# Altium schematic sheet STM32G473CET6_PINOUT.SchDoc
size C; SheetNumber: 6; SheetTotal: 10
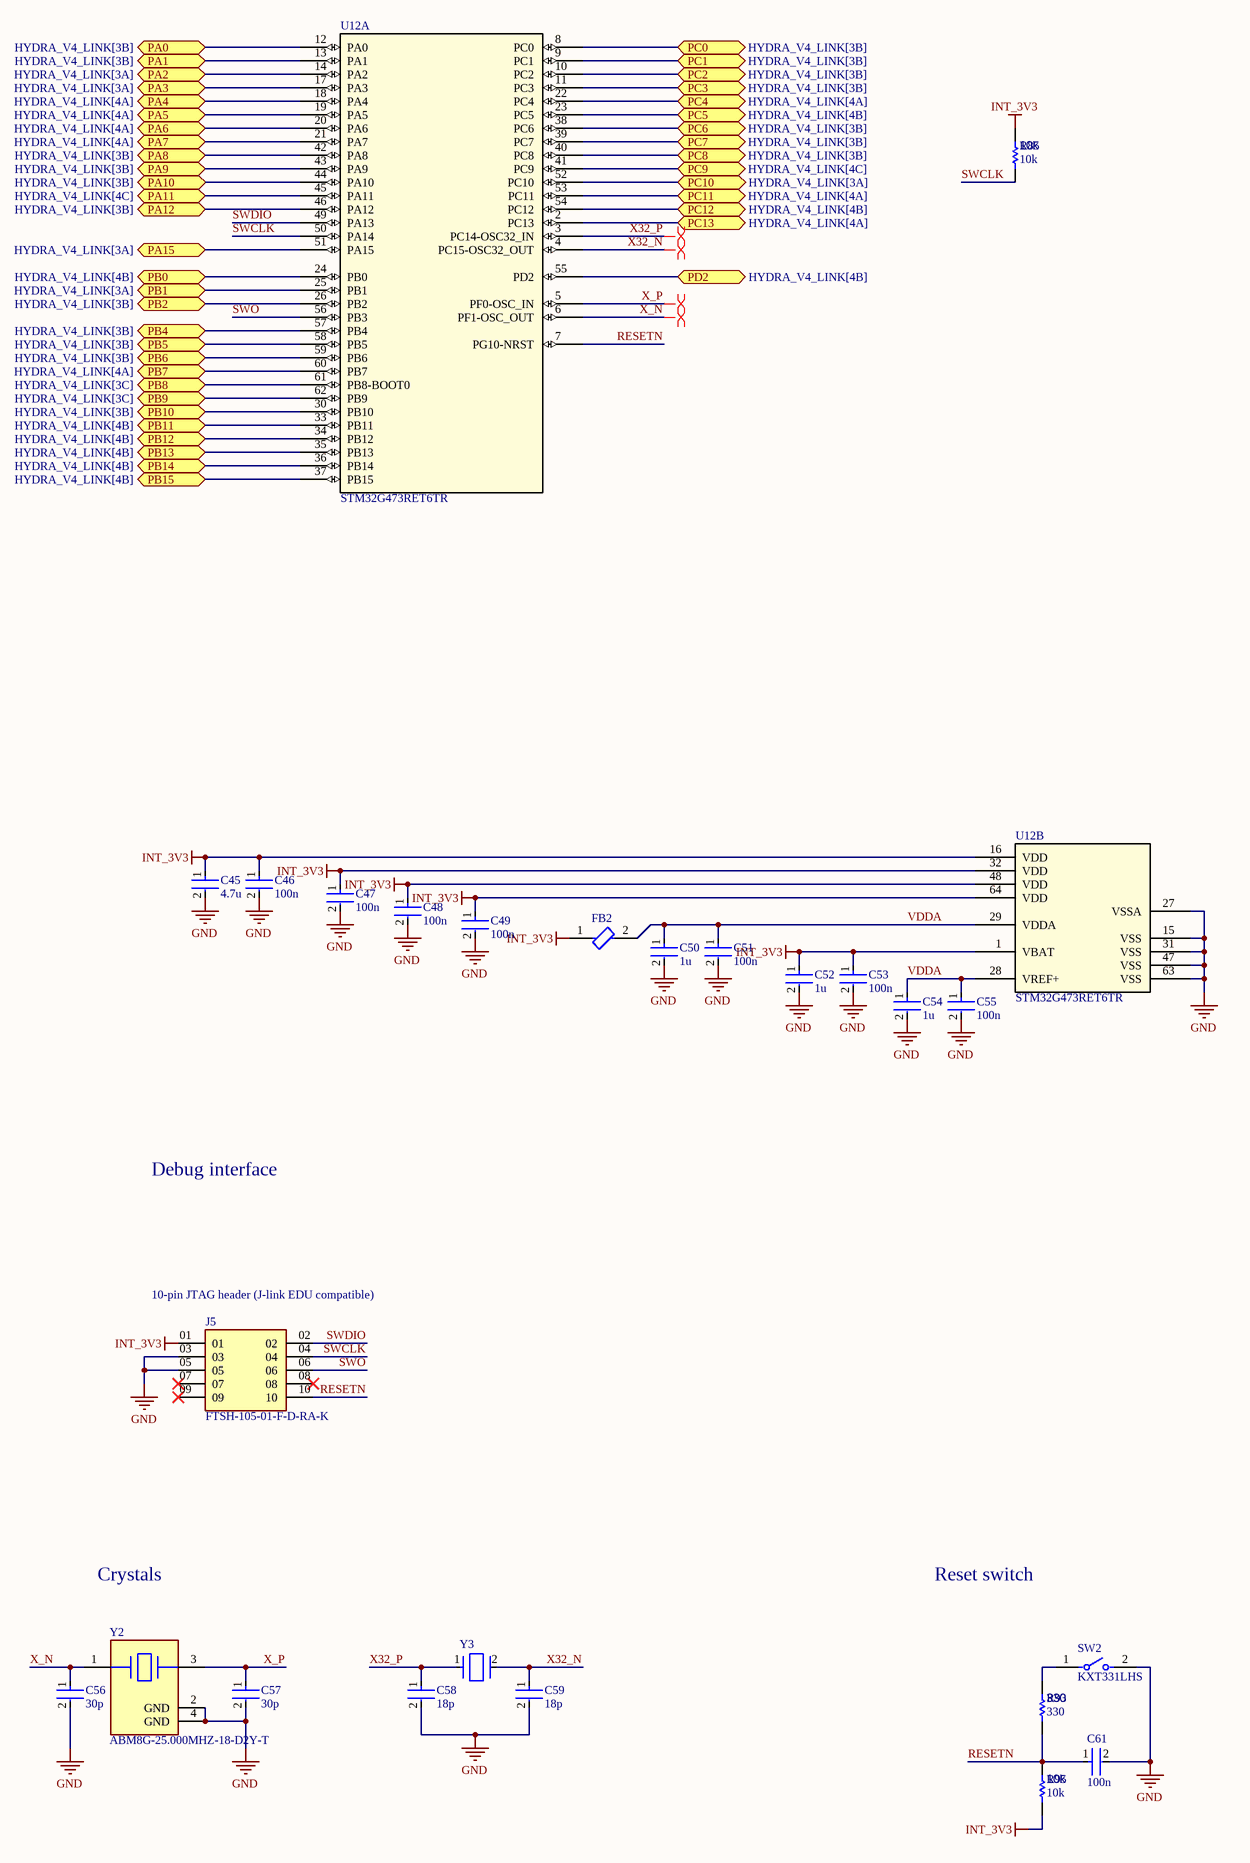
[diagram p0: STM32G473CET6_PINOUT.SchDoc]

## Parts
C45  4.7u  [FP-0402-L_1_0_0_05-W_0_5-IPC_A]
C46  100n  [FP-0402-L_1_0_0_05-W_0_5-IPC_A]
C47  100n  [FP-0402-L_1_0_0_05-W_0_5-IPC_A]
C48  100n  [FP-0402-L_1_0_0_05-W_0_5-IPC_A]
C49  100n  [FP-0402-L_1_0_0_05-W_0_5-IPC_A]
C50  1u  [FP-0402-L_1_0_0_05-W_0_5-IPC_A]
C51  100n  [FP-0402-L_1_0_0_05-W_0_5-IPC_A]
C52  1u  [FP-0402-L_1_0_0_05-W_0_5-IPC_A]
C53  100n  [FP-0402-L_1_0_0_05-W_0_5-IPC_A]
C54  1u  [FP-0402-L_1_0_0_05-W_0_5-IPC_A]
C55  100n  [FP-0402-L_1_0_0_05-W_0_5-IPC_A]
C56  30p  [FP-0402-L_1_0_0_05-W_0_5-IPC_A]
C57  30p  [FP-0402-L_1_0_0_05-W_0_5-IPC_A]
C58  18p  [FP-0402-L_1_0_0_05-W_0_5-IPC_A]
C59  18p  [FP-0402-L_1_0_0_05-W_0_5-IPC_A]
C61  100n  [FP-0402-L_1_0_0_05-W_0_5-IPC_A]
FB2  BLM15PX601SN1D  [FP-BLM15-0_05-MFG]  (value not drawn)
J5  FTSH-105-01-F-D-RA-K  [FTSH-105-01-F-D-RA-K-Footprint-1]
R85  10k  [R0603B]
R93  330  [R0603B]
R95  10k  [R0603B]
SW2  KXT331LHS  [FP-KXT331LHS-MFG]
U12  STM32G473RET6TR  [STM32G473RET6TR-Footprint-1]  (parts A,B of 2)
Y2  ABM8G-25.000MHZ-18-D2Y-T  [FP-ABM8G-MFG]
Y3  ECS-.327-12.5-1210-TR  [FP-ECX-1210-MFG]  (value not drawn)

## Ports
PA0 (bidir, see HYDRA_V4_LINK[3B]), PA1 (bidir, see HYDRA_V4_LINK[3B]), PA2 (bidir, see HYDRA_V4_LINK[3A]), PA3 (bidir, see HYDRA_V4_LINK[3A]), PA4 (bidir, see HYDRA_V4_LINK[4A]), PA5 (bidir, see HYDRA_V4_LINK[4A]), PA6 (bidir, see HYDRA_V4_LINK[4A]), PA7 (bidir, see HYDRA_V4_LINK[4A]), PA8 (bidir, see HYDRA_V4_LINK[3B]), PA9 (bidir, see HYDRA_V4_LINK[3B]), PA10 (bidir, see HYDRA_V4_LINK[3B]), PA11 (bidir, see HYDRA_V4_LINK[4C]), PA12 (bidir, see HYDRA_V4_LINK[3B]), PA15 (bidir, see HYDRA_V4_LINK[3A]), PB0 (bidir, see HYDRA_V4_LINK[4B]), PB1 (bidir, see HYDRA_V4_LINK[3A]), PB2 (bidir, see HYDRA_V4_LINK[3B]), PB4 (bidir, see HYDRA_V4_LINK[3B]), PB5 (bidir, see HYDRA_V4_LINK[3B]), PB6 (bidir, see HYDRA_V4_LINK[3B]), PB7 (bidir, see HYDRA_V4_LINK[4A]), PB8 (bidir, see HYDRA_V4_LINK[3C]), PB9 (bidir, see HYDRA_V4_LINK[3C]), PB10 (bidir, see HYDRA_V4_LINK[3B]), PB11 (bidir, see HYDRA_V4_LINK[4B]), PB12 (bidir, see HYDRA_V4_LINK[4B]), PB13 (bidir, see HYDRA_V4_LINK[4B]), PB14 (bidir, see HYDRA_V4_LINK[4B]), PB15 (bidir, see HYDRA_V4_LINK[4B]), PC0 (bidir, see HYDRA_V4_LINK[3B]), PC1 (bidir, see HYDRA_V4_LINK[3B]), PC2 (bidir, see HYDRA_V4_LINK[3B]), PC3 (bidir, see HYDRA_V4_LINK[3B]), PC4 (bidir, see HYDRA_V4_LINK[4A]), PC5 (bidir, see HYDRA_V4_LINK[4B]), PC6 (bidir, see HYDRA_V4_LINK[3B]), PC7 (bidir, see HYDRA_V4_LINK[3B]), PC8 (bidir, see HYDRA_V4_LINK[3B]), PC9 (bidir, see HYDRA_V4_LINK[4C]), PC10 (bidir, see HYDRA_V4_LINK[3A]), PC11 (bidir, see HYDRA_V4_LINK[4A]), PC12 (bidir, see HYDRA_V4_LINK[4B]), PC13 (bidir, see HYDRA_V4_LINK[4A]), PD2 (bidir, see HYDRA_V4_LINK[4B])

## Nets
GND: C45.2 C46.2 C47.2 C48.2 C49.2 C50.2 C51.2 C52.2 C53.2 C54.2 C55.2 C56.2 C57.2 C58.2 C59.2 C61.2 J5.03 J5.05 SW2.2 U12.15(VSS) U12.27(VSSA) U12.31(VSS) U12.47(VSS) U12.63(VSS) Y2.2(GND) Y2.4(GND)
INT_3V3: C45.1 C46.1 C47.1 C48.1 C49.1 C52.1 C53.1 FB2.1 J5.01 R85.2 R95.1 U12.1(VBAT) U12.16(VDD) U12.32(VDD) U12.48(VDD) U12.64(VDD)
PA0: U12.12(PA0) ; port PA0
PA1: U12.13(PA1) ; port PA1
PA2: U12.14(PA2) ; port PA2
PA3: U12.17(PA3) ; port PA3
PA4: U12.18(PA4) ; port PA4
PA5: U12.19(PA5) ; port PA5
PA6: U12.20(PA6) ; port PA6
PA7: U12.21(PA7) ; port PA7
PA8: U12.42(PA8) ; port PA8
PA9: U12.43(PA9) ; port PA9
PA10: U12.44(PA10) ; port PA10
PA11: U12.45(PA11) ; port PA11
PA12: U12.46(PA12) ; port PA12
PA15: U12.51(PA15) ; port PA15
PB0: U12.24(PB0) ; port PB0
PB1: U12.25(PB1) ; port PB1
PB2: U12.26(PB2) ; port PB2
PB4: U12.57(PB4) ; port PB4
PB5: U12.58(PB5) ; port PB5
PB6: U12.59(PB6) ; port PB6
PB7: U12.60(PB7) ; port PB7
PB8: U12.61(PB8-BOOT0) ; port PB8
PB9: U12.62(PB9) ; port PB9
PB10: U12.30(PB10) ; port PB10
PB11: U12.33(PB11) ; port PB11
PB12: U12.34(PB12) ; port PB12
PB13: U12.35(PB13) ; port PB13
PB14: U12.36(PB14) ; port PB14
PB15: U12.37(PB15) ; port PB15
PC0: U12.8(PC0) ; port PC0
PC1: U12.9(PC1) ; port PC1
PC2: U12.10(PC2) ; port PC2
PC3: U12.11(PC3) ; port PC3
PC4: U12.22(PC4) ; port PC4
PC5: U12.23(PC5) ; port PC5
PC6: U12.38(PC6) ; port PC6
PC7: U12.39(PC7) ; port PC7
PC8: U12.40(PC8) ; port PC8
PC9: U12.41(PC9) ; port PC9
PC10: U12.52(PC10) ; port PC10
PC11: U12.53(PC11) ; port PC11
PC12: U12.54(PC12) ; port PC12
PC13: U12.2(PC13) ; port PC13
PD2: U12.55(PD2) ; port PD2
RESETN: C61.1 J5.10 R93.1 R95.2 U12.7(PG10-NRST)
SWCLK: J5.04 R85.1 U12.50(PA14)
SWDIO: J5.02 U12.49(PA13)
SWO: J5.06 U12.56(PB3)
VDDA: C50.1 C51.1 C54.1 C55.1 FB2.2 U12.28(VREF+) U12.29(VDDA)
X32_N: C59.1 U12.4(PC15-OSC32_OUT) Y3.2(Out/In)
X32_P: C58.1 U12.3(PC14-OSC32_IN) Y3.1(In/Out)
X_N: C56.1 U12.6(PF1-OSC_OUT) Y2.1
X_P: C57.1 U12.5(PF0-OSC_IN) Y2.3
NetR93_2: R93.2 SW2.1

Not connected (* = marked no-connect by the designer): J5 07* 08* 09*

## Layout directives
differential pair: X32_N, X32_P, X_N, X_P

## Notes on the sheet
- Debug interface
- (near J5) 10-pin JTAG header (J-link EDU compatible)
- Crystals
- Reset switch

## Library data of the parts
C45-C59 C61 = CMP-001-00058-1: LARGE PADS, 0402 CAP, CHANGE COMMENT TO MATCH REAL P/N; Capacitor Type: Ceramic; Min Operating Temperature: -55°C; Mounting Technology: Surface Mount; Pins: 2; Case/Package: 0402; RoHS Compliant: Yes; Max Operating Temperature: 85°C
  C45: Value: 4.7u
  C46-C49 C51 C53 C55 C61: Value: 100n
  C50 C52 C54: Value: 1u
  C56 C57: Value: 30p
  C58 C59: Value: 18p
FB2 = CMP-0686-00252-4: Chip Ferrite Bead, 0402, 600Ω @ 100MHz, 0.23Ω, 25%, 900mA; Number of Circuits: 1; Impedance: 600R; DC Resistance (DCR): 230mR; Material: Steel; Length: 1mm; Package Quantity: 10000; Height: 0.5mm; Width: 0.5mm; Max DC Current: 900mA; Number of Lines: 1; Termination: SMD/SMT; Packaging: Tape and Reel; Lead Free: Lead Free; Min Operating Temperature: -55°C; Max Operating Temperature: 125°C; Max Current Rating: 900mA; Case Code (Imperial): 0402; Number of Pins: 2; Current Rating: 900mA; Test Frequency: 100MHz; Case/Package: 0402; Tolerance: 25%; Case Code (Metric): 1005
J5 = CMP-002-00041-5: Board Connector, 10 Contact(s), 2 Row(s), Male, Right Angle, 0.05 inch Pitch, Surface Mount Terminal, Locking, Black Insulator; Connector Type: BOARD CONNECTOR; Mounting Technology: Board; RoHS Compliant: Yes
R85 R93 R95 = CMP-009-00002-14: Resistor
  R85 R95: Value: 10k
  R93: Value: 330
SW2 = CMP-10040-000029-1: SWITCH TACTILE SPST-NO 0.02A 15V; Operating Force: 240gf; Switch Travel: 0.13mm; Illumination Type: Non-Illuminated; Throw Configuration: SPST; Number of Ports: 1; Current Rating: 5A; Mechanical Life: 500000Cycles; Switch Function: Off-Mom; Connector Type: USB; Actuator Type: Standard; Gender: Receptacle; Number of Contacts: 24; Contact Plating: Gold; Insulation Color: Black; Min Operating Temperature: -40°C; Packaging: Tape and Reel; Flammability Rating: UL94 V-0; Max Operating Temperature: 85°C; Termination: Solder; Mount: Surface Mount
U12 = CMP-020-00020-2: MCU 32-Bit STM32 ARM Cortex-M4 RISC 512KB Flash 1.71V to 3.6V 64-Pin LQFP T/R; RoHS Compliant: Yes
Y2 = CMP-2000-05733-3: Crystal 25MHz ±20ppm (Tol) ±30ppm (Stability) 18pF FUND 60Ω 4-Pin SMD T/R; Series Resistance: 60R; Length: 3.2mm; Depth: 2.5mm; Packaging: Tape and Reel; Min Operating Temperature: -40°C; Operating Frequency: 25 MHz; Lead Free: Lead Free; Number of Pins: 4; Frequency Tolerance: 20ppm; Radiation Hardening: No; Max Operating Temperature: 85°C; Termination: SMD/SMT; Frequency Stability: 30ppm; Frequency: 25MHz; Series: ABM8G; Mount: Surface Mount; Package Quantity: 1000; Height: 0.039inch; Width: 0.098inch; Case/Package: CSMD; ESR (Equivalent Series Resistance): 60R; Load Capacitance: 18pF; Tolerance: 20ppm
Y3 = CMP-40224-000006-1: CRYSTAL 32.7680KHZ 12.5PF SMD; Manufacturer: ECS International; Frequency: 32.768kHz; Esr: 90kΩ; Tolerance: 20ppm; Device Class L1: Passive Components; Load Capacitance: 12.5pF; Temperature: -40°C to +85°C; ComponentLink2URL: https://ecsxtal.com/store/pdf/ECX-1210.pdf; Series: ECX-1210; Octopart: https://octopart.com/ecs-.327-12.5-1210-tr-ecs+international-81221340; ComponentLink2Description: Datasheet; Temperature Range Low: -40°C; Digikey Description: CRYSTAL 32.7680KHZ 12.5PF SMD; Lead Free: Yes; RoHS: TRUE; Device Class L3: Crystals; Automotive: No; Category: Crys; Height: 0.5mm; Manufacturer Part Number: ECS-.327-12.5-1210-TR; Temperature Range High: +85°C; Device Class L2: Crystals / Oscillators; Package: ECX-1210